# Altium schematic sheet DDR4.SchDoc
size A4
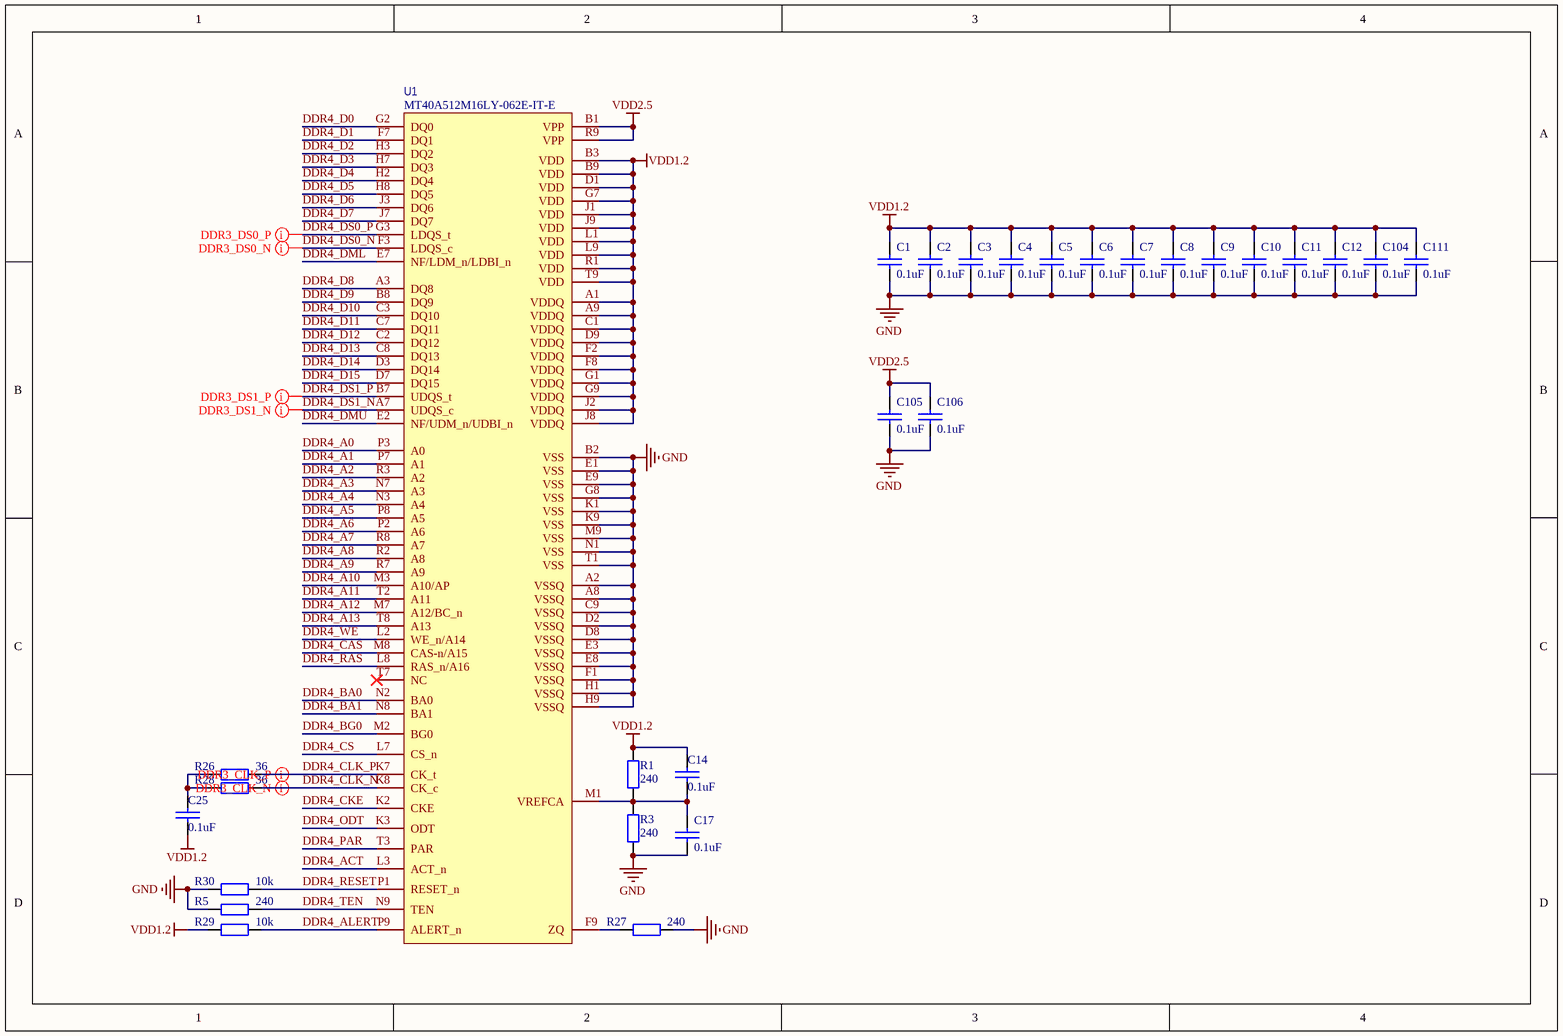
[diagram p0: DDR4.SchDoc]

## Parts
C1  0.1uF  [0402_c_m]
C2  0.1uF  [0402_c_m]
C3  0.1uF  [0402_c_m]
C4  0.1uF  [0402_c_m]
C5  0.1uF  [0402_c_m]
C6  0.1uF  [0402_c_m]
C7  0.1uF  [0402_c_m]
C8  0.1uF  [0402_c_m]
C9  0.1uF  [0402_c_m]
C10  0.1uF  [0402_c_m]
C11  0.1uF  [0402_c_m]
C12  0.1uF  [0402_c_m]
C14  0.1uF  [0402_c_m]
C17  0.1uF  [0402_c_m]
C25  0.1uF  [0402_c_m]
C104  0.1uF  [0402_c_m]
C105  0.1uF  [0402_c_m]
C106  0.1uF  [0402_c_m]
C111  0.1uF  [0402_c_m]
R1  240  [0402_r_m]
R3  240  [0402_r_m]
R5  240  [0402_R_M]
R26  36  [0402_r_m]
R27  240  [0402_R_M]
R28  36  [0402_r_m]
R29  10k  [0402_r_m]
R30  10k  [0402_r_m]
U1  MT40A512M16LY-062E-IT-E  [MT40A512M16LY-062E-IT-E]

## Nets
GND: C1.2 C2.2 C3.2 C4.2 C5.2 C6.2 C7.2 C8.2 C9.2 C10.2 C11.2 C12.2 C17.2 C104.2 C105.2 C106.2 C111.2 R3.1 R5.2 R27.1 R30.2 U1.A2(VSSQ) U1.A8(VSSQ) U1.B2(VSS) U1.C9(VSSQ) U1.D2(VSSQ) U1.D8(VSSQ) U1.E1(VSS) U1.E3(VSSQ) U1.E8(VSSQ) U1.E9(VSS) U1.F1(VSSQ) U1.G8(VSS) U1.H1(VSSQ) U1.H9(VSSQ) U1.K1(VSS) U1.K9(VSS) U1.M9(VSS) U1.N1(VSS) U1.T1(VSS)
VDD1.2: C1.1 C2.1 C3.1 C4.1 C5.1 C6.1 C7.1 C8.1 C9.1 C10.1 C11.1 C12.1 C14.1 C25.1 C104.1 C111.1 R1.2 R29.2 U1.A1(VDDQ) U1.A9(VDDQ) U1.B3(VDD) U1.B9(VDD) U1.C1(VDDQ) U1.D1(VDD) U1.D9(VDDQ) U1.F2(VDDQ) U1.F8(VDDQ) U1.G1(VDDQ) U1.G7(VDD) U1.G9(VDDQ) U1.J1(VDD) U1.J2(VDDQ) U1.J8(VDDQ) U1.J9(VDD) U1.L1(VDD) U1.L9(VDD) U1.R1(VDD) U1.T9(VDD)
VDD2.5: C105.1 C106.1 U1.B1(VPP) U1.R9(VPP)
DDR4_A0: U1.P3(A0)
DDR4_A1: U1.P7(A1)
DDR4_A2: U1.R3(A2)
DDR4_A3: U1.N7(A3)
DDR4_A4: U1.N3(A4)
DDR4_A5: U1.P8(A5)
DDR4_A6: U1.P2(A6)
DDR4_A7: U1.R8(A7)
DDR4_A8: U1.R2(A8)
DDR4_A9: U1.R7(A9)
DDR4_A10: U1.M3(A10/AP)
DDR4_A11: U1.T2(A11)
DDR4_A12: U1.M7(A12/BC_n)
DDR4_A13: U1.T8(A13)
DDR4_ACT: U1.L3(ACT_n)
DDR4_ALERT: R29.1 U1.P9(ALERT_n)
DDR4_BA0: U1.N2(BA0)
DDR4_BA1: U1.N8(BA1)
DDR4_BG0: U1.M2(BG0)
DDR4_CAS: U1.M8(CAS-n/A15)
DDR4_CKE: U1.K2(CKE)
DDR4_CLK_N: R28.2 U1.K8(CK_c)
DDR4_CLK_P: R26.2 U1.K7(CK_t)
DDR4_CS: U1.L7(CS_n)
DDR4_D0: U1.G2(DQ0)
DDR4_D1: U1.F7(DQ1)
DDR4_D2: U1.H3(DQ2)
DDR4_D3: U1.H7(DQ3)
DDR4_D4: U1.H2(DQ4)
DDR4_D5: U1.H8(DQ5)
DDR4_D6: U1.J3(DQ6)
DDR4_D7: U1.J7(DQ7)
DDR4_D8: U1.A3(DQ8)
DDR4_D9: U1.B8(DQ9)
DDR4_D10: U1.C3(DQ10)
DDR4_D11: U1.C7(DQ11)
DDR4_D12: U1.C2(DQ12)
DDR4_D13: U1.C8(DQ13)
DDR4_D14: U1.D3(DQ14)
DDR4_D15: U1.D7(DQ15)
DDR4_DML: U1.E7(NF/LDM_n/LDBI_n)
DDR4_DMU: U1.E2(NF/UDM_n/UDBI_n)
DDR4_DS0_N: U1.F3(LDQS_c)
DDR4_DS0_P: U1.G3(LDQS_t)
DDR4_DS1_N: U1.A7(UDQS_c)
DDR4_DS1_P: U1.B7(UDQS_t)
DDR4_ODT: U1.K3(ODT)
DDR4_PAR: U1.T3(PAR)
DDR4_RAS: U1.L8(RAS_n/A16)
DDR4_RESET: R30.1 U1.P1(RESET_n)
DDR4_TEN: R5.1 U1.N9(TEN)
DDR4_WE: U1.L2(WE_n/A14)
NetC14_2: C14.2 C17.1 R1.1 R3.2 U1.M1(VREFCA)
NetC25_2: C25.2 R26.1 R28.1
NetR27_2: R27.2 U1.F9(ZQ)

Not connected (* = marked no-connect by the designer): U1 T7(NC)*

## Layout directives
differential pair: DDR4_CLK_N, DDR4_CLK_P, DDR4_DS0_N, DDR4_DS0_P, DDR4_DS1_N, DDR4_DS1_P

## Library data of the parts
C1-C12 C14 C17 C25 C104-C106 C111 = CAP
R1 R3 R5 R26-R30 = RES2
U1 = MT40A512M16LY-062E IT:E